# EAGLE design Kube-Module-PS (EAGLE 9.4.2)
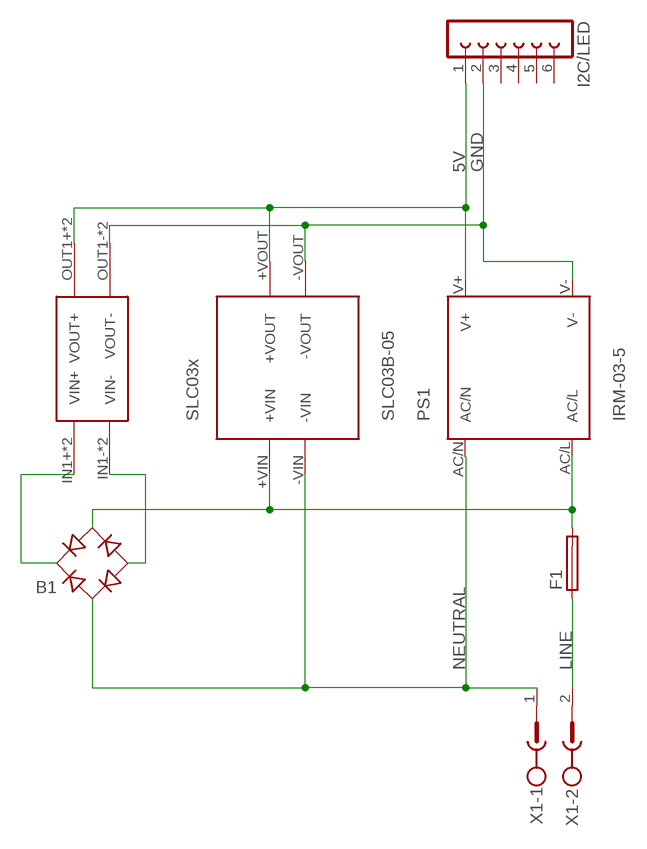
[diagram p0: schematic, sheet 1]

## Parts
B1  RB1A  [RB1A]
F1  LITTLEFUSE  [LITTLEFUSE]
I2C/LED  FE06-1  [FE06]
MP1584  MP1584  [DC-BRICK]
PS1  IRM-03-5  IRM_03IRM_03  [IRM_03]
SLC03X  SLC03B-05  SLC03XSLC03X  [SLC03X]
X1  MSTBV2  [MSTBV2]

## Nets
5V [Thick]: I2C/LED.1 MP1584.OUT1+(VOUT+) MP1584.OUT2+(VOUT+) PS1.V+ SLC03X.+VOUT
GND: I2C/LED.2 MP1584.OUT1-(VOUT-) MP1584.OUT2-(VOUT-) PS1.V- SLC03X.-VOUT
LINE [Thick]: F1.1 X1.2
LINE-FUSED [Thick]: B1.AC2 F1.2 PS1.AC/L SLC03X.+VIN
NEUTRAL [Thick]: B1.AC1 PS1.AC/N SLC03X.-VIN X1.1
V+ [Thick]: B1.+ MP1584.IN1+(VIN+) MP1584.IN2+(VIN+)
V- [Thick]: B1.- MP1584.IN1-(VIN-) MP1584.IN2-(VIN-)
Unconnected: I2C/LED.3 I2C/LED.4 I2C/LED.5 I2C/LED.6

## Library data of the parts
B1 = rectifier:RB1A: RECTIFIER 1 A
F1 = fuse:LITTLEFUSE: LITTLEFUSE Picofuse/slow Littlefuse; OC_FARNELL: unknown; OC_NEWARK: unknown
I2C/LED = con-lsta:FE06-1: FEMALE HEADER; OC_FARNELL: unknown; OC_NEWARK: unknown
MP1584 = MP1584-dc-brick:MP1584: MP1584-dc-brick-pcb Step down Input: 4.5V - 28V Ouput 0.8V - 25V max. 3A Cheap on ebay
PS1 = meanwell_irm_v7:IRM_03: 3 watt IRM 03 Vout [V] Imax [A] Pmax [W] Eff [%] 3.3 0.9 3 68 5 0.6 3 72 9 0.33 3 77 12 0.25 3 78 15 0.2 3 78 24 0.125 3 80
SLC03X = meanwell_slc03:SLC03X: Mean Well SLC03B-05 5V DC/DC converter
X1 = con-phoenix-500:MSTBV2: PHOENIX; OC_FARNELL: unknown; OC_NEWARK: unknown

## Net classes
1 Thick: width 1.27 mm, clearance 0.635 mm

## Board
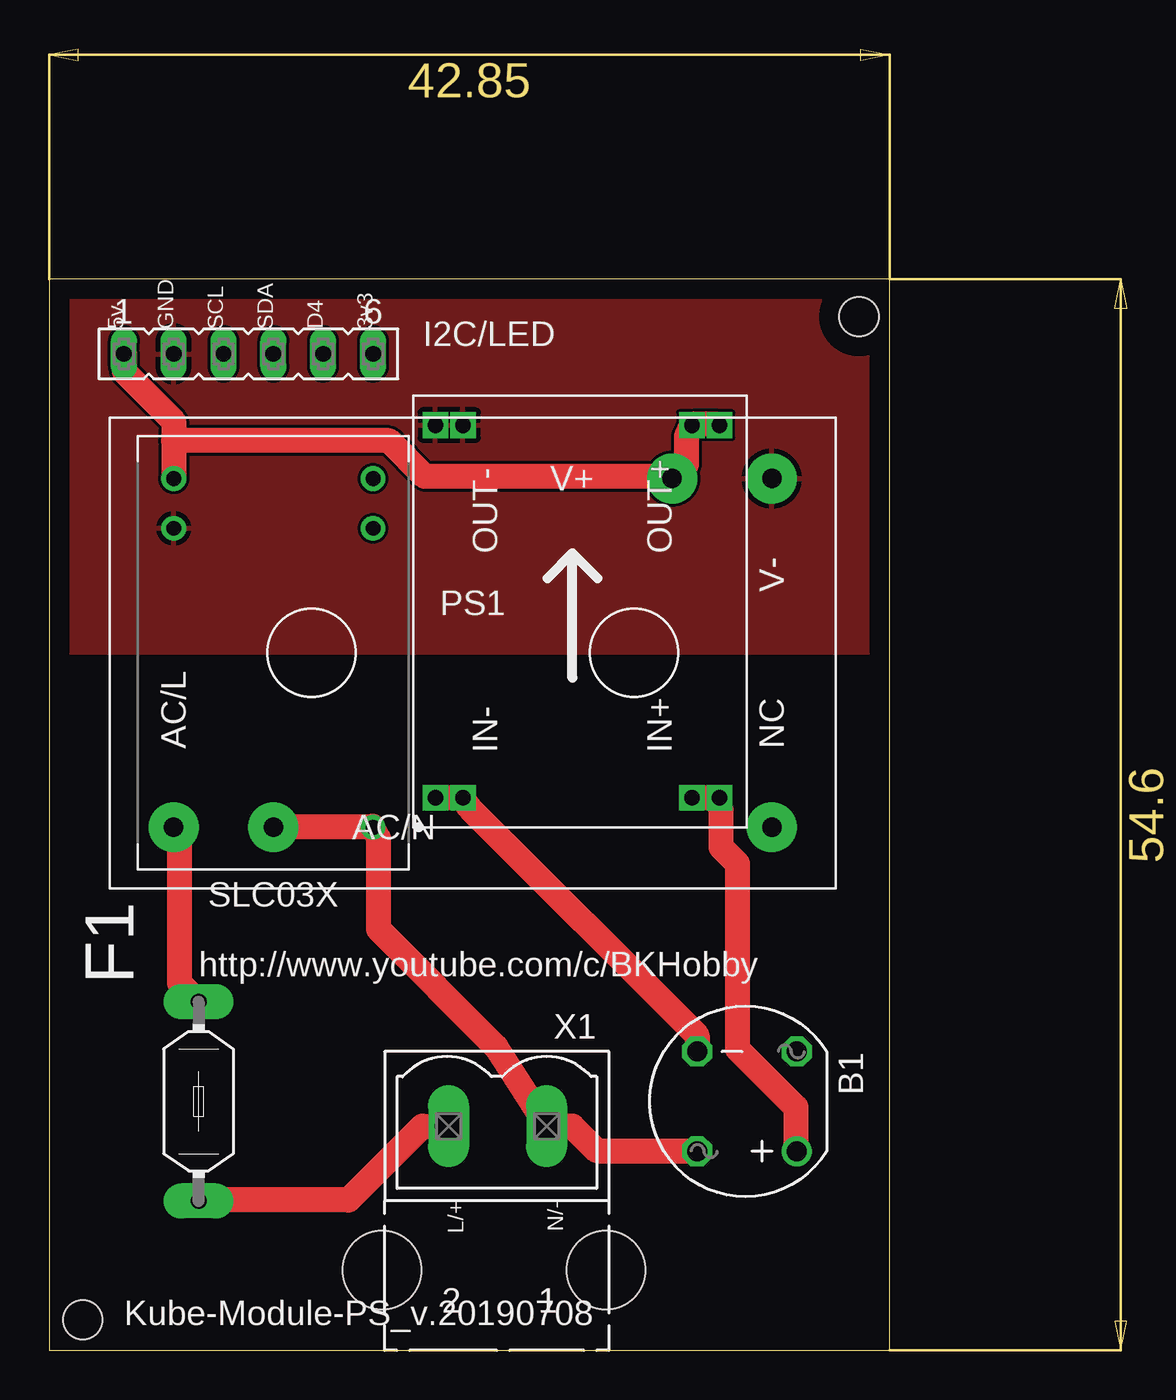
[diagram p1: board, top side]
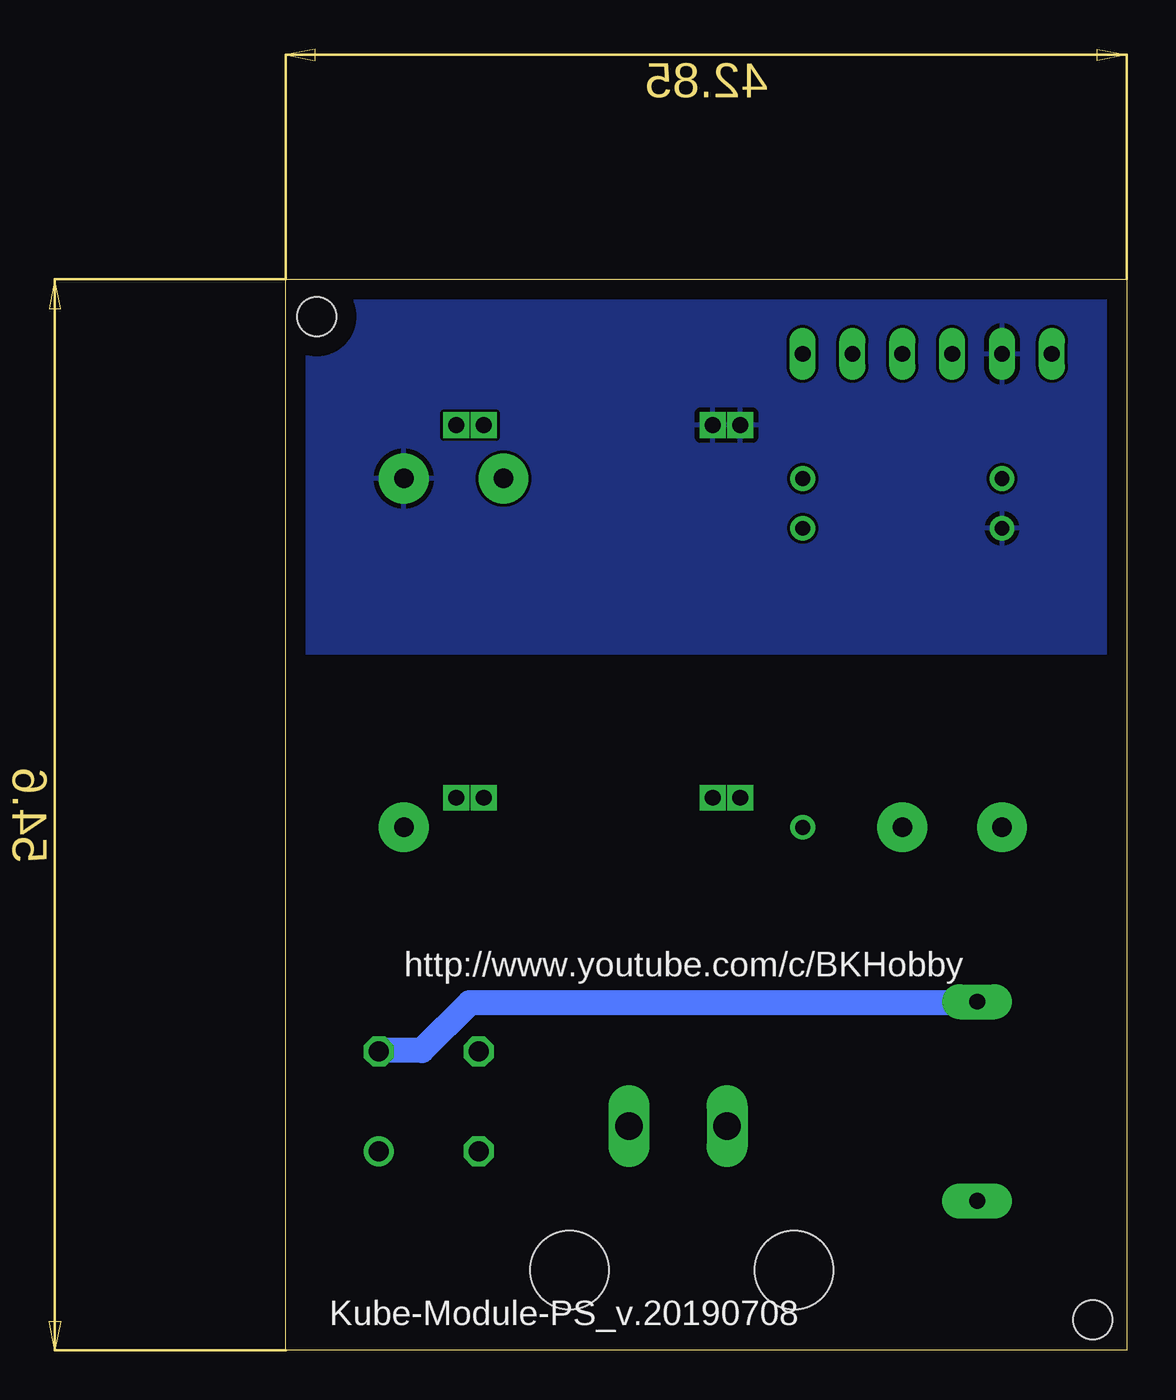
[diagram p2: board, bottom side, seen from below]

Size 42.85 x 54.6 mm. Coordinates in mm from the lower left corner, seen from the top.
Outline: 0,0 42.85,0 42.85,54.6 0,54.6 0,0
Copper layers (1*16): Top 0.035mm / dielectric 1.5mm / Bottom 0.035mm
Design rules "default": minimum track width 6mil, minimum drill 0.35mm, track to track 6mil, track to pad 6mil, pad to pad 6mil, via to via 6mil, smd to smd 6mil, copper to edge 40mil, drill to drill 6mil, minimum pad ring 10mil, minimum via ring 8mil, stop-mask expansion 4mil, vias tented up to drill 0mil, thermal gap 10mil
Holes 2 mm at 41.27,52.7 1.72,1.56
Holes 4 mm at 16.96,4.1 28.39,4.1

### Footprints (pad centres in the part's own frame; a part is rotated, then mirrored left to right if it is on the bottom)
RB1A = drill 1.016: + -2.54,2.54 | drill 1.016 octagon: - 2.54,-2.54; AC1 2.54,2.54; AC2 -2.54,-2.54
LITTLEFUSE = drill 0.813 pad 1.778 long: 1 -5.08,0; 2 5.08,0
FE06 = drill 0.813 long: 1 -6.35,0; 2 -3.81,0; 3 -1.27,0; 4 1.27,0; 5 3.81,0; 6 6.35,0
DC-BRICK = drill 0.8 square: IN1+ 1.5,1.4; IN1- 1.5,14.47; IN2+ 1.5,2.8; IN2- 1.5,15.87; OUT1+ 20.5,1.4; OUT1- 20.5,14.47; OUT2+ 20.5,2.8; OUT2- 20.5,15.87
IRM_03 = drill 1 pad 2.54: AC/L -15.24,-8.89; AC/N -10.16,-8.89; NC 15.24,-8.89; V+ 10.16,8.89; V- 15.24,8.89
SLC03X = drill 0.759 pad 1.259: +VIN 5.08,8.89; +VOUT 5.08,-8.89; -VIN -5.08,8.89; -VOUT 5.08,-6.35; COMMON -5.08,-8.89; N.C. -5.08,-6.35
MSTBV2 = drill 1.397 long: 1 -2.5,0; 2 2.5,0

### Placement (x,y rotation side)
B1  35.56,12.7 180 top
F1  7.62,12.7 90 top
I2C/LED  10.16,50.8 0 top
MP1584  35.56,26.67 90 top
PS1  21.59,35.56 0 top
SLC03X  11.43,35.56 180 top
X1  22.86,11.43 180 top

### Tracks (layer width: path | path; a pad name or v marks a point on that pad's centre or on a via)
5V
  Top 1.27: 6.35,46.38 6.35,47.37 3.83,49.89 3.83,50.8 I2C/LED.1 | 6.35,46.38 SLC03X.+VOUT | MP1584.OUT1+ 34.09,47.22 32.79,47.22 MP1584.OUT2+ 32.49,46.61 32.49,45.16 31.8,44.47 PS1.V+ 31.11,44.55 19.15,44.55 17.32,46.38 6.35,46.38
GND
  pour Top: 0,35.56 43.18,35.56 43.18,54.61 0,54.61
  pour Bottom: 0,54.61 43.18,54.61 43.18,35.56 0,35.56
LINE
  Top 1.27: F1.1 7.64,7.67 15.26,7.67 19.02,11.43 X1.2
LINE-FUSED
  Top 1.27: 6.35,26.72 SLC03X.+VIN 6.65,26.11 6.65,18.72 7.57,17.8 F1.2
  Bottom 1.27: B1.AC2 38.05,15.29 35.92,15.29 33.48,17.73 7.64,17.73 F1.2
NEUTRAL
  Top 1.27: PS1.AC/N 11.45,26.72 16.48,26.72 SLC03X.-VIN 16.79,26.11 16.79,21.46 22.77,15.48 X1.1 26.67,11.43 27.91,10.18 33.02,10.18 B1.AC1
V+
  Top 1.27: MP1584.IN2+ 32.79,28.17 34.09,28.17 MP1584.IN1+ 34.24,27.56 34.24,25.65 35.08,24.82 35.08,15.37 38.05,12.39 38.05,10.18 B1.+
V-
  Top 1.27: MP1584.IN2- 19.76,28.17 21.06,28.17 MP1584.IN1- 21.44,27.64 33.02,16.05 B1.-

### Text on the board
tNames: 5v | GND | SCL | SDA | D4 | 3v3 | http://www.youtube.com/c/BKHobby | L/+ | N/- | Kube-Module-PS_v.20190708
bNames: http://www.youtube.com/c/BKHobby | Kube-Module-PS_v.20190708